# Altium schematic sheet fpc.schdoc: FPC
size A4; Date: 04.10.2026; CheckedBy: BCY; DrawnBy: miaow; Revision: v1.0.0; SheetNumber: 16; SheetTotal: 18; BoardType: MAIN_PCB; Desc: FPC
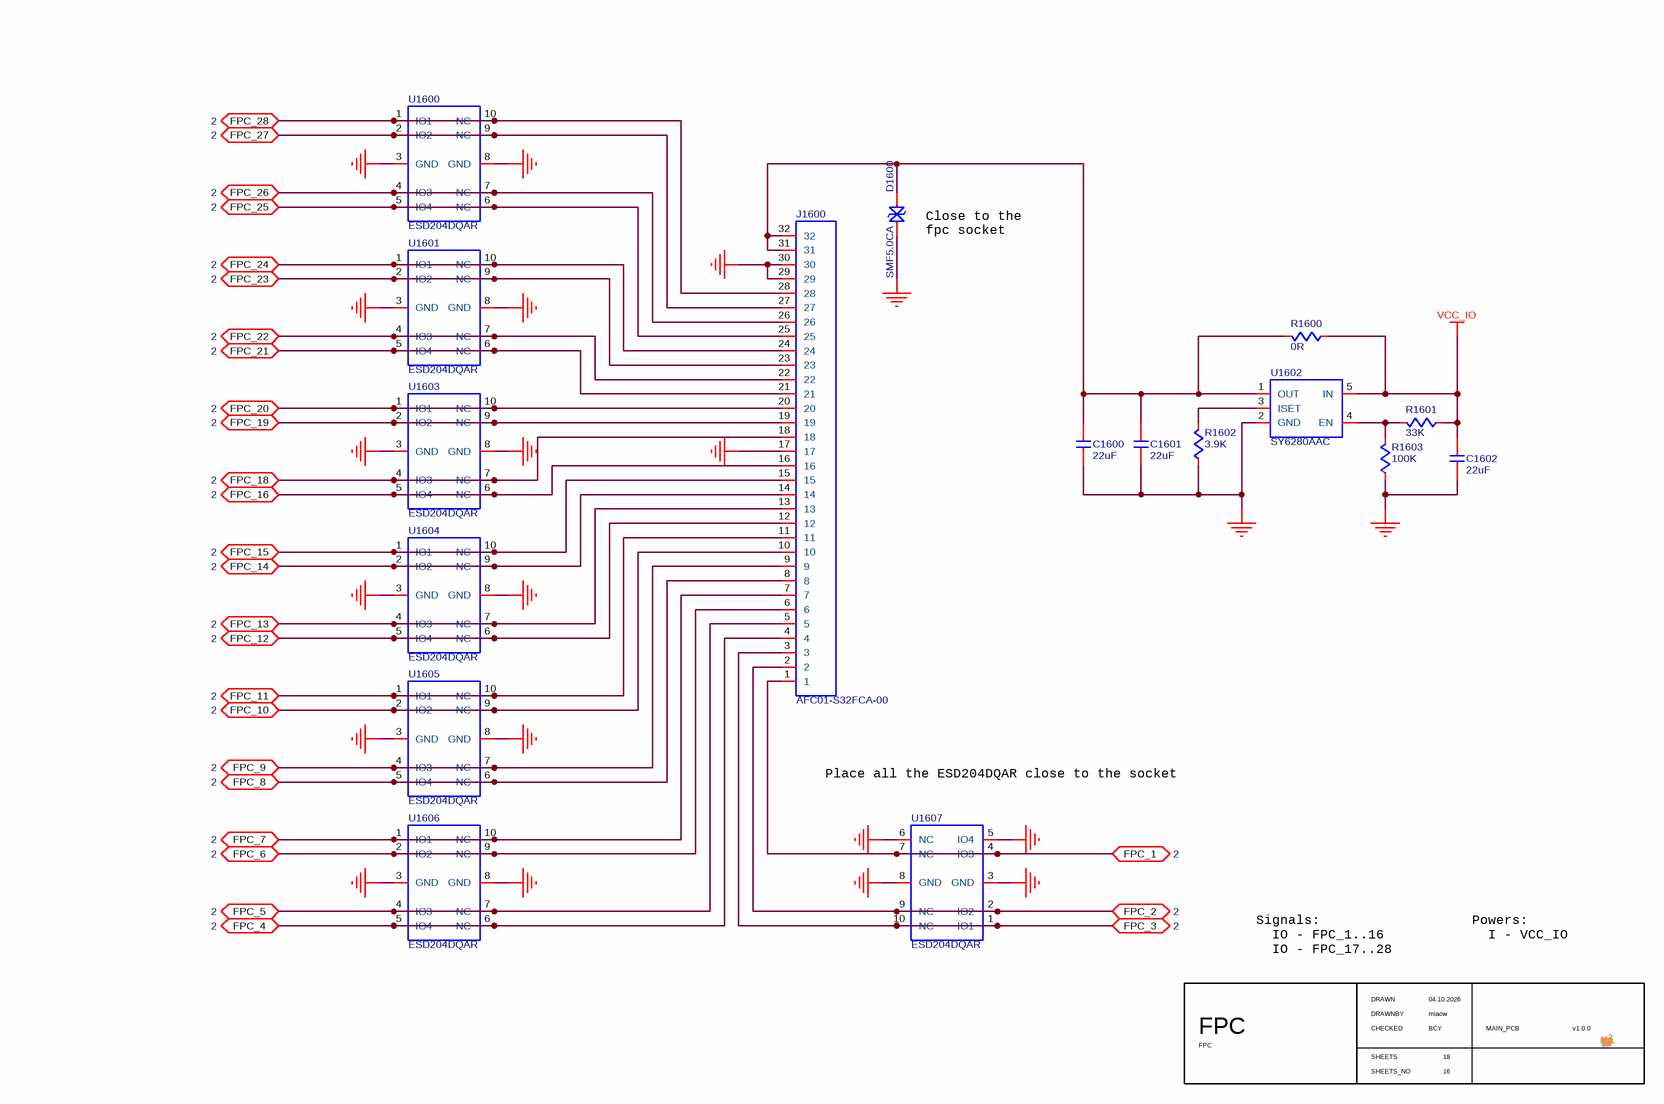
[diagram p0: fpc.schdoc]

## Parts
C1600  value 22uF  [C0603]  (hidden comment: C-NOMO)
C1601  value 22uF  [C0603]  (hidden comment: C-NOMO)
C1602  value 22uF  [C0603]  (hidden comment: C-NOMO)
D1600  SMF5.0CA  [SMF5.0CA]
J1600  AFC01-S32FCA-00  [AFC01-S32FCA-00]
R1600  value 0R  [R1206]  (hidden comment: R)
R1601  value 33K  [R0402]  (hidden comment: R)
R1602  value 3.9K  [R0402]  (hidden comment: R)
R1603  value 100K  [R0402]  (hidden comment: R)
U1600  ESD204DQAR  [ESD204DQAR]
U1601  ESD204DQAR  [ESD204DQAR]
U1602  SY6280AAC  [SY6280AAC]
U1603  ESD204DQAR  [ESD204DQAR]
U1604  ESD204DQAR  [ESD204DQAR]
U1605  ESD204DQAR  [ESD204DQAR]
U1606  ESD204DQAR  [ESD204DQAR]
U1607  ESD204DQAR  [ESD204DQAR]

## Ports
FPC_1 (bidir, see 2), FPC_2 (bidir, see 2), FPC_3 (bidir, see 2), FPC_4 (bidir, see 2), FPC_5 (bidir, see 2), FPC_6 (bidir, see 2), FPC_7 (bidir, see 2), FPC_8 (bidir, see 2), FPC_9 (bidir, see 2), FPC_10 (bidir, see 2), FPC_11 (bidir, see 2), FPC_12 (bidir, see 2), FPC_13 (bidir, see 2), FPC_14 (bidir, see 2), FPC_15 (bidir, see 2), FPC_16 (bidir, see 2), FPC_18 (bidir, see 2), FPC_19 (bidir, see 2), FPC_20 (bidir, see 2), FPC_21 (bidir, see 2), FPC_22 (bidir, see 2), FPC_23 (bidir, see 2), FPC_24 (bidir, see 2), FPC_25 (bidir, see 2), FPC_26 (bidir, see 2), FPC_27 (bidir, see 2), FPC_28 (bidir, see 2)

## Nets
GND: C1600.2 C1601.2 C1602.2 D1600.1 J1600.17 J1600.29 J1600.30 R1602.2 R1603.2 U1600.3(GND) U1600.8(GND) U1601.3(GND) U1601.8(GND) U1602.2(GND) U1603.3(GND) U1603.8(GND) U1604.3(GND) U1604.8(GND) U1605.3(GND) U1605.8(GND) U1606.3(GND) U1606.8(GND) U1607.3(GND) U1607.5(IO4) U1607.6(NC) U1607.8(GND)
VCC_IO: C1602.1 R1600.2 R1601.2 U1602.5(IN)
FPC_1: J1600.1 U1607.4(IO3) U1607.7(NC) ; port FPC_1
FPC_2: J1600.2 U1607.2(IO2) U1607.9(NC) ; port FPC_2
FPC_3: J1600.3 U1607.1(IO1) U1607.10(NC) ; port FPC_3
FPC_4: J1600.4 U1606.5(IO4) U1606.6(NC) ; port FPC_4
FPC_5: J1600.5 U1606.4(IO3) U1606.7(NC) ; port FPC_5
FPC_6: J1600.6 U1606.2(IO2) U1606.9(NC) ; port FPC_6
FPC_7: J1600.7 U1606.1(IO1) U1606.10(NC) ; port FPC_7
FPC_8: J1600.8 U1605.5(IO4) U1605.6(NC) ; port FPC_8
FPC_9: J1600.9 U1605.4(IO3) U1605.7(NC) ; port FPC_9
FPC_10: J1600.10 U1605.2(IO2) U1605.9(NC) ; port FPC_10
FPC_11: J1600.11 U1605.1(IO1) U1605.10(NC) ; port FPC_11
FPC_12: J1600.12 U1604.5(IO4) U1604.6(NC) ; port FPC_12
FPC_13: J1600.13 U1604.4(IO3) U1604.7(NC) ; port FPC_13
FPC_14: J1600.14 U1604.2(IO2) U1604.9(NC) ; port FPC_14
FPC_15: J1600.15 U1604.1(IO1) U1604.10(NC) ; port FPC_15
FPC_16: J1600.16 U1603.5(IO4) U1603.6(NC) ; port FPC_16
FPC_18: J1600.18 U1603.4(IO3) U1603.7(NC) ; port FPC_18
FPC_19: J1600.19 U1603.2(IO2) U1603.9(NC) ; port FPC_19
FPC_20: J1600.20 U1603.1(IO1) U1603.10(NC) ; port FPC_20
FPC_21: J1600.21 U1601.5(IO4) U1601.6(NC) ; port FPC_21
FPC_22: J1600.22 U1601.4(IO3) U1601.7(NC) ; port FPC_22
FPC_23: J1600.23 U1601.2(IO2) U1601.9(NC) ; port FPC_23
FPC_24: J1600.24 U1601.1(IO1) U1601.10(NC) ; port FPC_24
FPC_25: J1600.25 U1600.5(IO4) U1600.6(NC) ; port FPC_25
FPC_26: J1600.26 U1600.4(IO3) U1600.7(NC) ; port FPC_26
FPC_27: J1600.27 U1600.2(IO2) U1600.9(NC) ; port FPC_27
FPC_28: J1600.28 U1600.1(IO1) U1600.10(NC) ; port FPC_28
NetC1600_1: C1600.1 C1601.1 D1600.2 J1600.31 J1600.32 R1600.1 U1602.1(OUT)
NetR1601_1: R1601.1 R1603.1 U1602.4(EN)
NetR1602_1: R1602.1 U1602.3(ISET)

## Notes on the sheet
- (near D1600) Close to the fpc socket
- Place all the ESD204DQAR close to the socket
- Signals:
  IO - FPC_1..16
  IO - FPC_17..28
- Powers:
  I - VCC_IO
- DRAWN
- CHECKED
- DRAWNBY
- SHEETS
- SHEETS_NO

## Library data of the parts
C1600-C1602 = C-NOMO: voltage: 10V; precision: 20%; Supplier 1: LCSC; Supplier Part Number 1: C2980159
D1600 = SMF5.0CA: TVS/ESD; Supplier 1: LCSC; Supplier Part Number 1: C19077498
J1600 = AFC01-S32FCA-00: FPC - flip, 32p, 0.5mm; Supplier 1: LCSC; Supplier Part Number 1: C262672
R1600 = R: precision: 30mR; Supplier 1: LCSC; Supplier Part Number 1: C2907363
R1601-R1603 = R: precision: 1%; Supplier 1: LCSC
  R1601: Supplier Part Number 1: C25779
  R1602: Supplier Part Number 1: C51721
  R1603: Supplier Part Number 1: C25741
U1600 U1601 U1603-U1607 = ESD204DQAR: TVS/ESD - 4 ch, 3.6V, 5V, 0.55pF@1MHz, 30KV; Supplier 1: LCSC; Supplier Part Number 1: C553132
U1602 = SY6280AAC: PWR SWITCH; Supplier 1: LCSC; Supplier Part Number 1: C55136